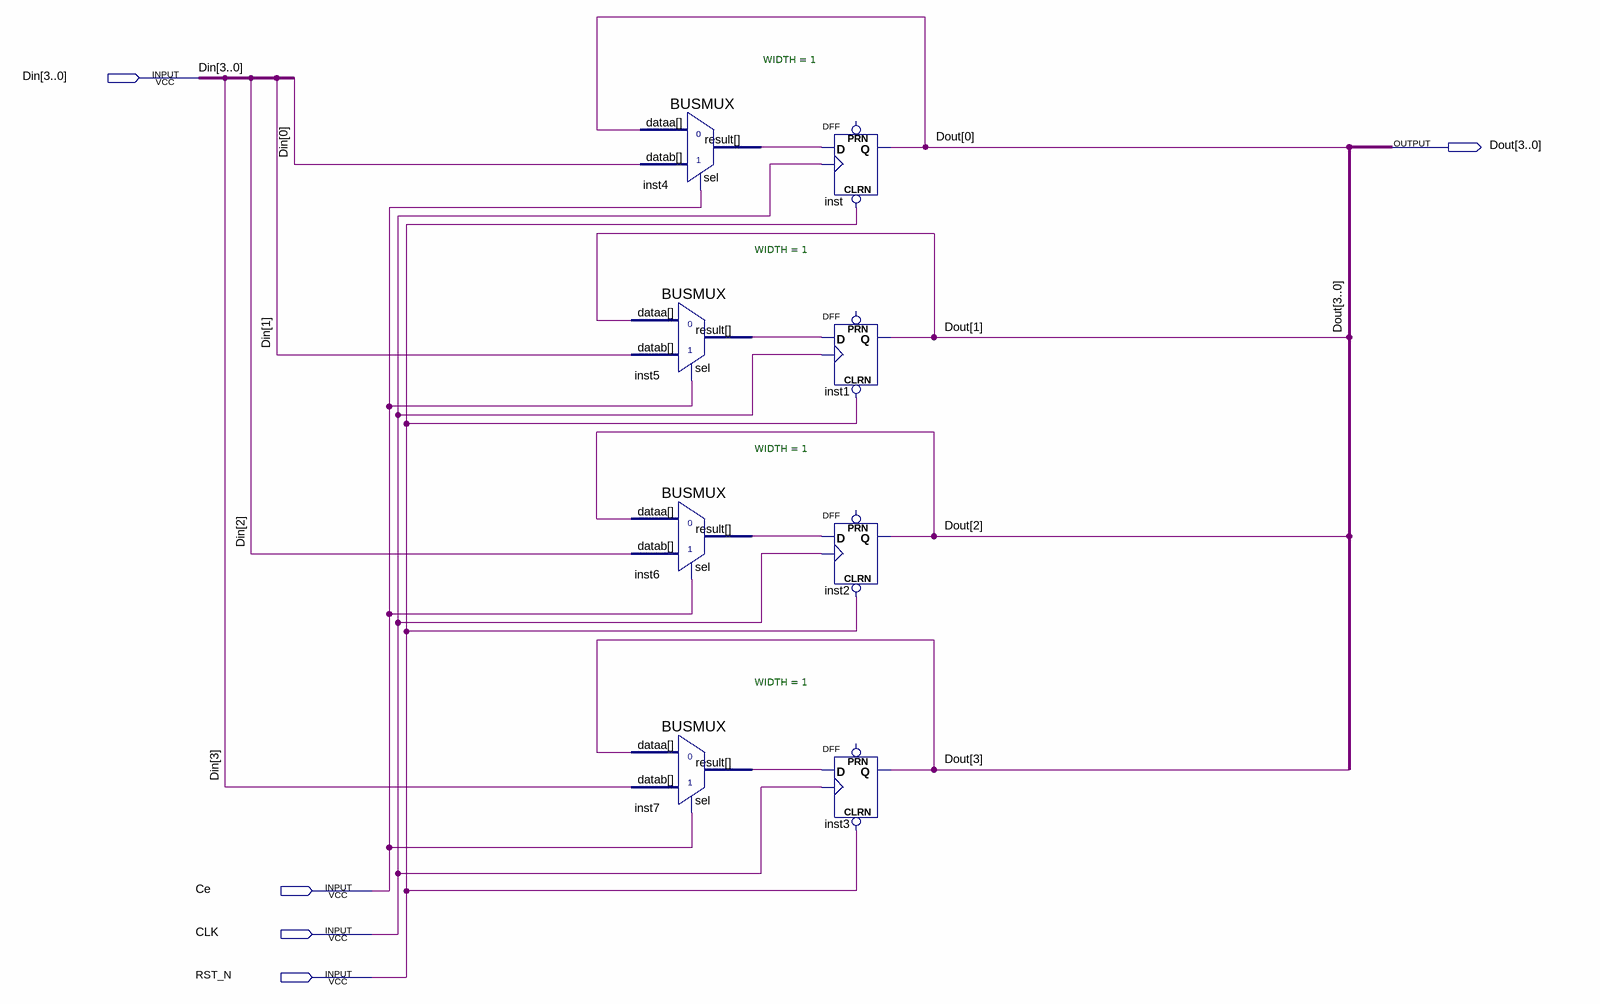
[diagram p0: schematic sheet]
// Quartus schematic fourbit_register.bdf as structural Verilog: 8 symbols, 5 pins
module fourbit_register (
  input  [3:0] Din,
  input  Ce,
  input  CLK,
  input  RST_N,
  output [3:0] Dout
);

  wire inst4_result, inst5_result, inst6_result, inst7_result;

  BUSMUX #(.WIDTH(1)) inst4 (.datab(Din[0]), .sel(Ce), .dataa(Dout[0]), .result(inst4_result));
  BUSMUX #(.WIDTH(1)) inst5 (.datab(Din[1]), .sel(Ce), .dataa(Dout[1]), .result(inst5_result));
  BUSMUX #(.WIDTH(1)) inst6 (.datab(Din[2]), .sel(Ce), .dataa(Dout[2]), .result(inst6_result));
  BUSMUX #(.WIDTH(1)) inst7 (.datab(Din[3]), .sel(Ce), .dataa(Dout[3]), .result(inst7_result));
  DFF inst (.CLRN(RST_N), .CLK(CLK), .D(inst4_result), .Q(Dout[0]));  // open: PRN
  DFF inst1 (.CLRN(RST_N), .CLK(CLK), .D(inst5_result), .Q(Dout[1]));  // open: PRN
  DFF inst2 (.CLRN(RST_N), .CLK(CLK), .D(inst6_result), .Q(Dout[2]));  // open: PRN
  DFF inst3 (.CLRN(RST_N), .CLK(CLK), .D(inst7_result), .Q(Dout[3]));  // open: PRN
endmodule
